# EAGLE schematic Slim-CC1101-NRF24L01-Adapter (EAGLE 9.6.2)
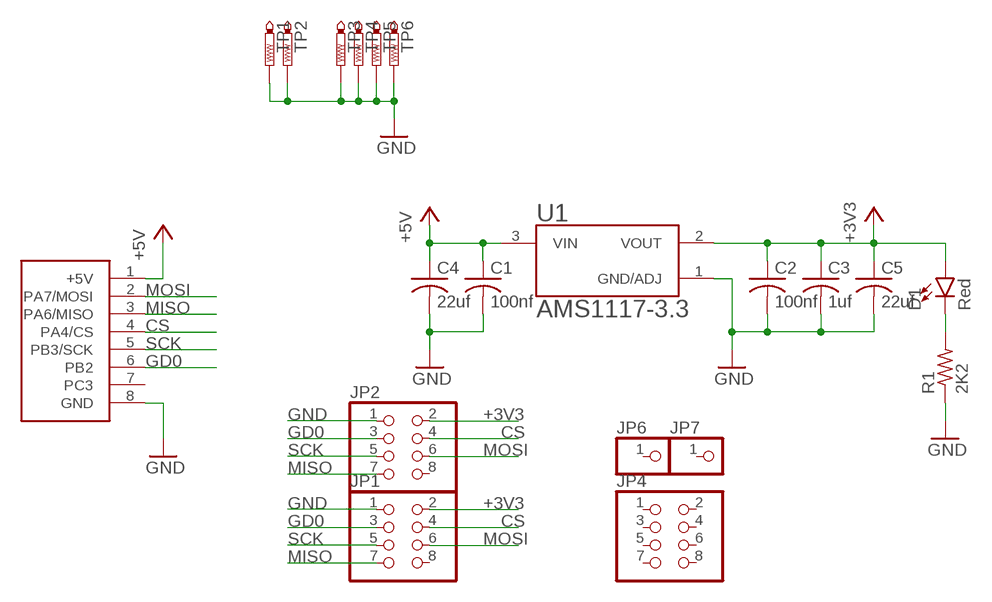
[diagram p0: schematic, sheet 1]

## Parts
C1  100nf  C-USC0805  [C0805]
C2  100nf  C-USC0805  [C0805]
C3  1uf  C-USC0805  [C0805]
C4  22uf  C-USC3216  [C3216]
C5  22uf  C-USC3216  [C3216]
D1  Red  LED-RED1206  [LED-1206]
JP1  PINHD-2X4  [2X04]
JP2  PINHD-2X4  [2X04]
JP4  PINHD-2X4  [2X04]
JP6  PINHD-1X1  [1X01]
JP7  PINHD-1X1  [1X01]
R1  2K2  R-US_R0805  [R0805]
TP1  PTR1B1,27  [B1,27]
TP2  PTR1B1,27  [B1,27]
TP3  PTR1B2,54  [B2,54]
TP4  PTR1B2,54  [B2,54]
TP5  PTR1B2,54  [B2,54]
TP6  PTR1B2,54  [B2,54]
U1  AMS1117-3.3  [SOT229P700X180-4N]
U$1  LEFT-H1-SMD  [LEFT-H1-SMD]

## Nets
+3V3: C2.1 C3.1 C5.1 D1.A JP1.2 JP2.2 U1.2(VOUT)
+5V: C1.1 C4.1 U1.3(VIN) U$1.1(+5V)
CS: JP1.4 JP2.4 U$1.4(PA4/CS)
GD0: JP1.3 JP2.3 U$1.6(PB2)
GND: C1.2 C2.2 C3.2 C4.2 C5.2 JP1.1 JP2.1 R1.1 TP1.TP TP2.TP TP3.TP TP4.TP TP5.TP TP6.TP U1.1(GND/ADJ) U$1.8(GND)
MISO: JP1.7 JP2.7 U$1.3(PA6/MISO)
MOSI: JP1.6 JP2.6 U$1.2(PA7/MOSI)
N$1: D1.C R1.2
SCK: JP1.5 JP2.5 U$1.5(PB3/SCK)
Unconnected: JP1.8 JP2.8 JP4.1 JP4.2 JP4.3 JP4.4 JP4.5 JP4.6 JP4.7 JP4.8 JP6.1 JP7.1 U$1.7(PC3)

## Library data of the parts
C1-C5 = rcl:C-US: CAPACITOR, American symbol; SPICEPREFIX: C
D1 = SparkFun-LED:LED-RED: Red SMD LED Used in manufacturing of most products at SparkFun Packages: 0603 - KB - KingBright (DIO-17976) SMD 0603 package [Datasheet] <https://www.kingbrightusa.com/images/catalog/SPEC/APT1608SURCK.pdf> 0603 - (DIO-00819, has gone EOL) SMD 0603 package 0603 SMART - SMD 0603 SMART package ( more efficient and expensive)[Product Link] <http://www.osram-os.com/Graphics/XPic2/00077099_0.pdf> 1206 - SMD1206 package [Product Link] <https://www.sparkfun.com/datasheets/DevTools/LilyPad/Q150OVS4.pdff> SparkFun Products: Pro Mini 328 -5V <https://www.sparkfun.com/products/821> RedBoard <https://www.sparkfun.com/products/12757> IOIO-OTG <https://www.sparkfun.com/products/13613>; PROD_ID: DIO-09912
JP1 JP2 JP4 = pinhead:PINHD-2X4: PIN HEADER
JP6 JP7 = pinhead:PINHD-1X1: PIN HEADER
R1 = rcl:R-US_: RESISTOR, American symbol; SPICEPREFIX: R
TP1-TP6 = testpad:PTR1: TEST PIN
U1 = AMS1117-3.3:AMS1117-3.3: Check availability <https://pricing.snapeda.com/parts/AMS1117-3.3/Advanced%20Monolithic%20Systems/view-part?ref=eda>; AVAILABILITY: Not in stock; CHECK_PRICES: https://www.snapeda.com/parts/AMS1117-3.3/Advanced+Monolithic+Systems/view-part/?ref=eda; DESCRIPTION: Sot223/Pkg 1-Amp 3.3-Volt Low Drop Out Voltage Regulatator; MF: Advanced Monolithic Systems; MP: AMS1117-3.3; PACKAGE: SOT-223 Seeed Technology; PRICE: None; SNAPEDA_LINK: https://www.snapeda.com/parts/AMS1117-3.3/Advanced+Monolithic+Systems/view-part/?ref=snap
U$1 = Flipper-Zero-GPIO-Headers:LEFT-H1-SMD